# EAGLE schematic Stackduino-1.2 (EAGLE 7.3.0)
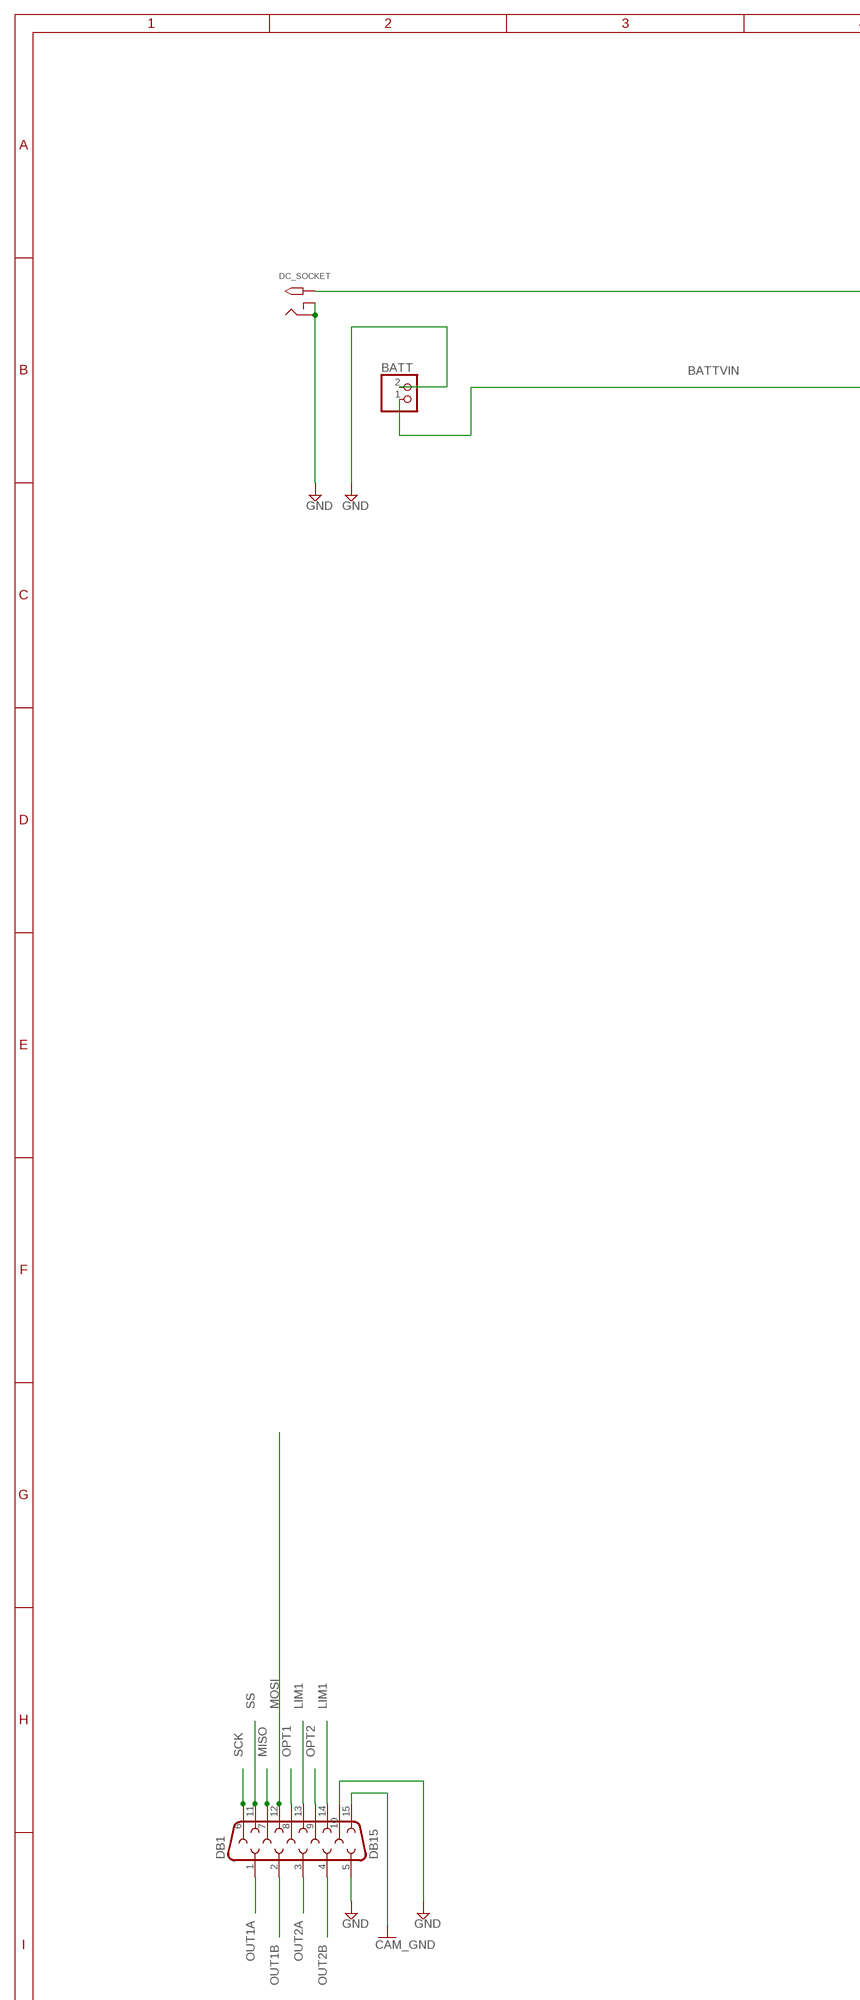
[diagram p0: schematic, sheet 1, part 1 of 2]
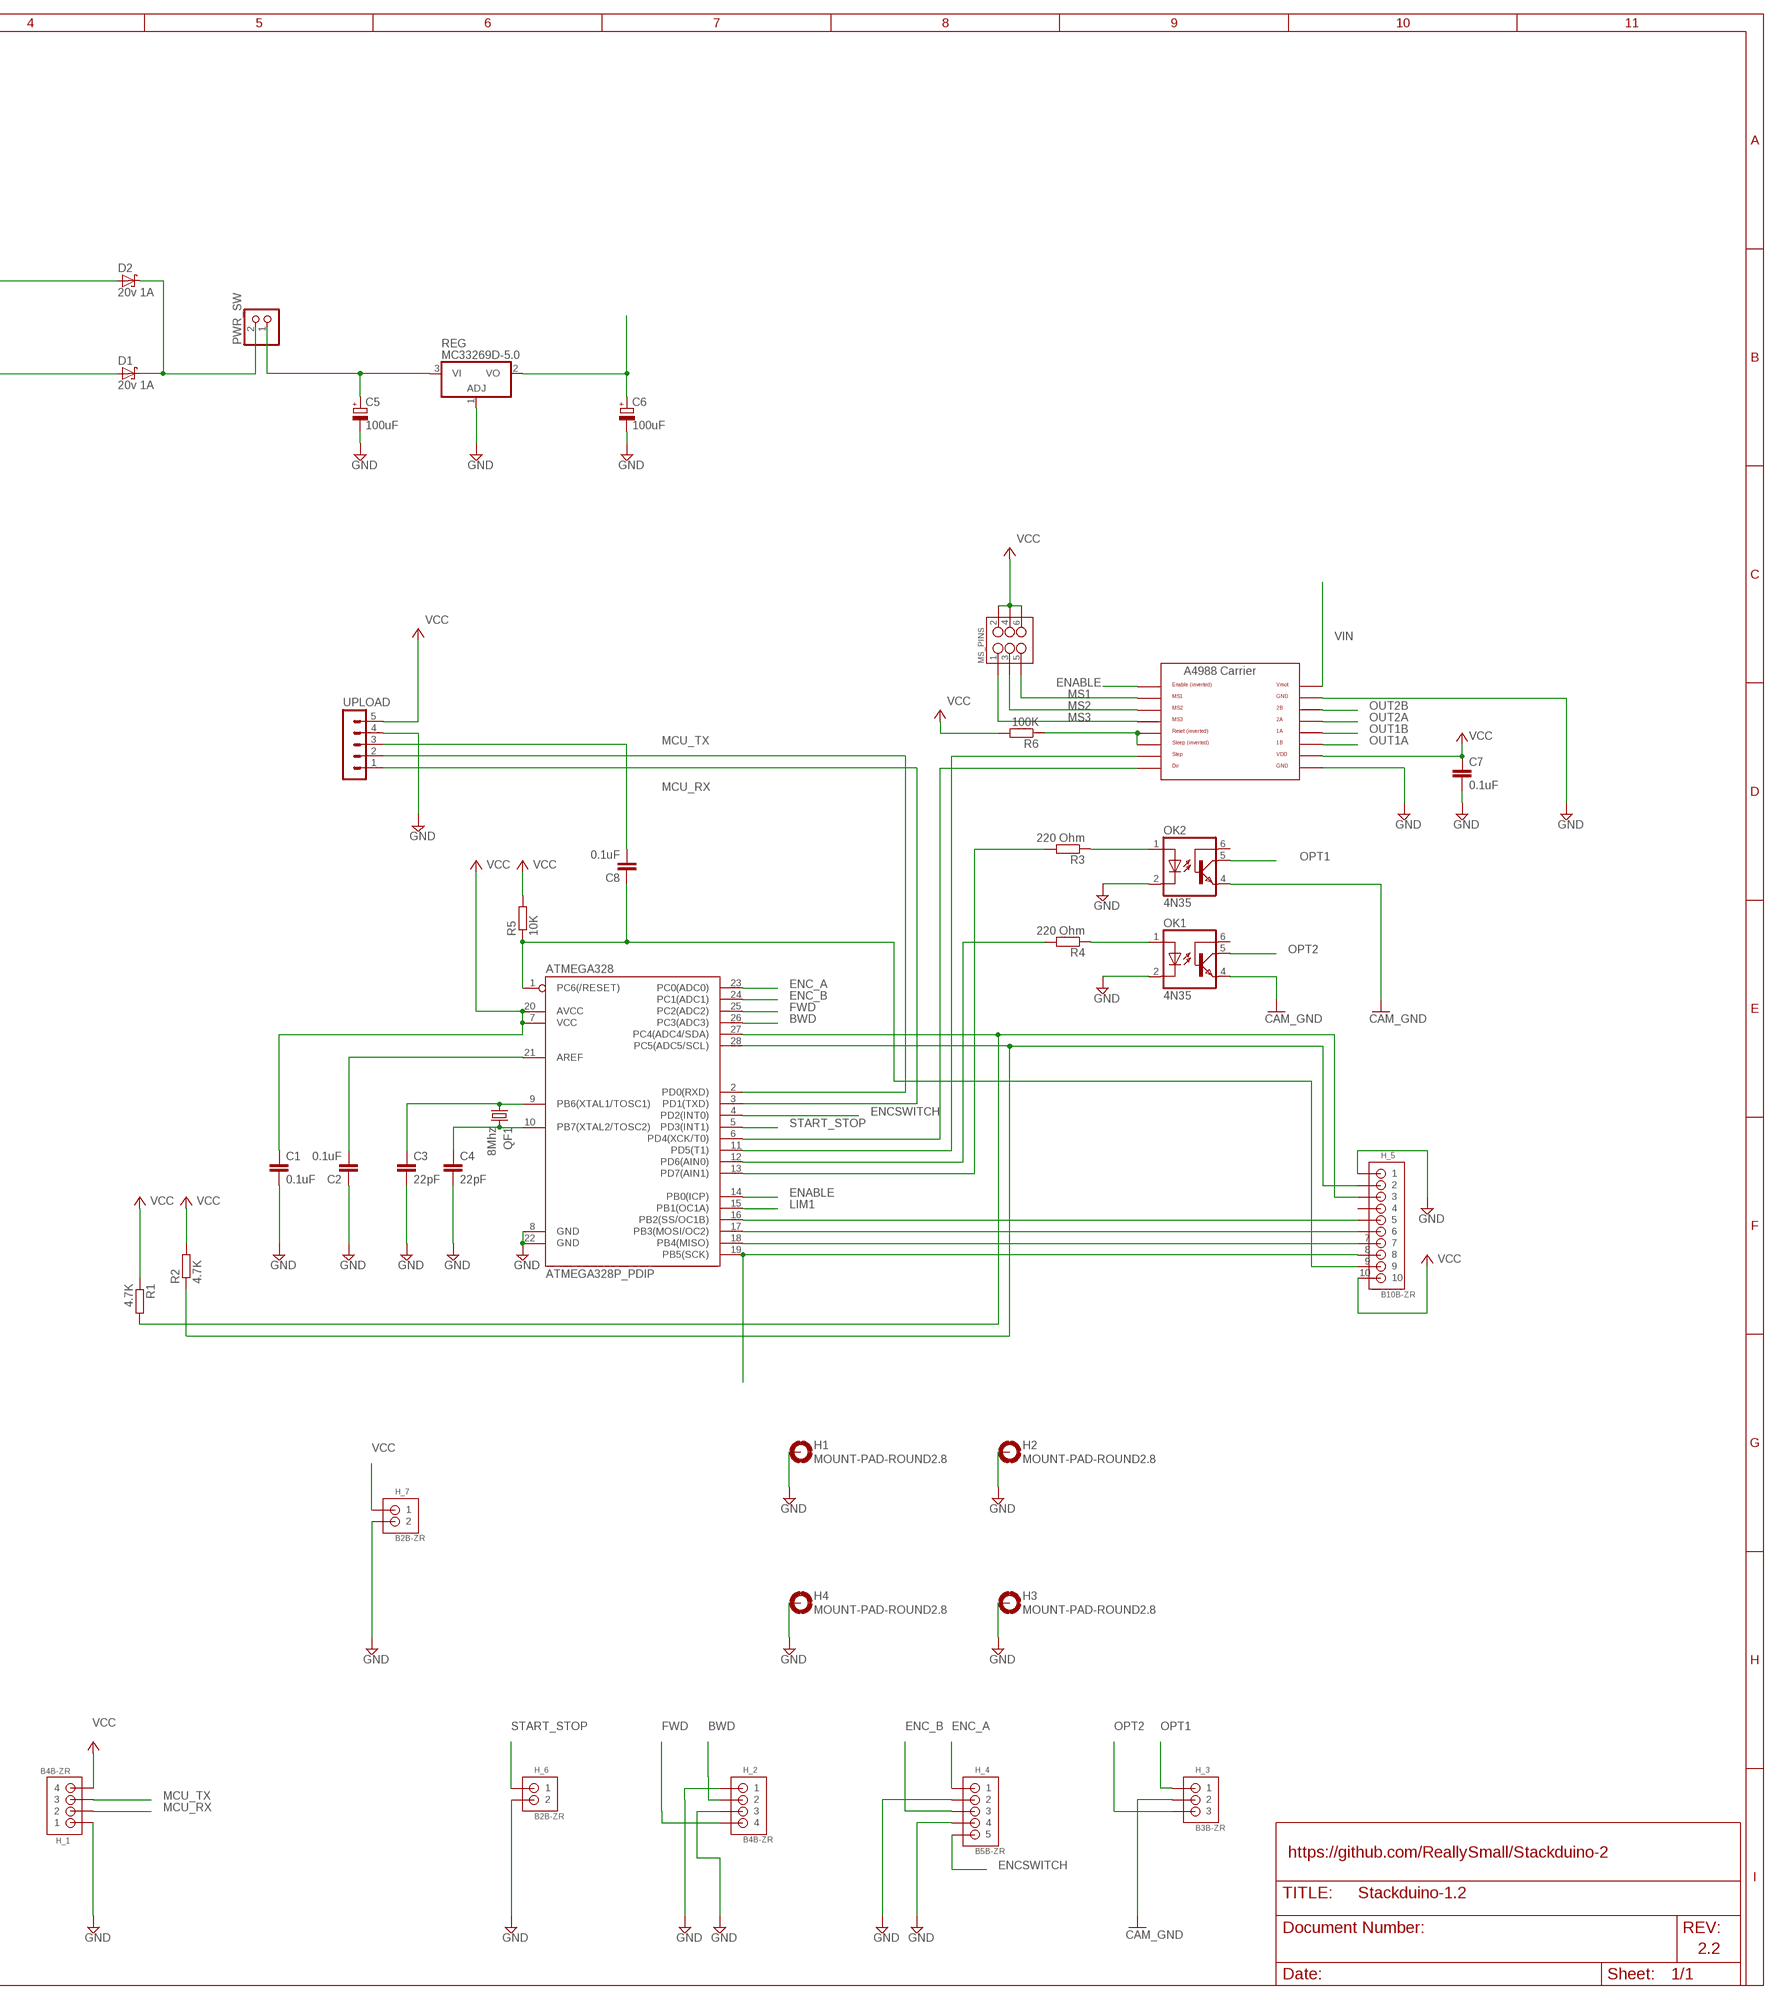
[diagram p1: schematic, sheet 1, part 2 of 2]

## Parts
A4988_CARRIER  A4988BREAKOUT  [A4988BREAKOUT]
ATMEGA328  ATMEGA328P_PDIP  [DIL28-3]
BATT  JST_2PIN-THM  [JST-PH-2-THM]
C1  0.1uF  C-EU025-030X050  [C025-030X050]
C2  0.1uF  C-EU025-030X050  [C025-030X050]
C3  22pF  C-EU025-030X050  [C025-030X050]
C4  22pF  C-EU025-030X050  [C025-030X050]
C5  100uF  CPOL-EUE2.5-7  [E2,5-7]
C6  100uF  CPOL-EUE2.5-7  [E2,5-7]
C7  0.1uF  C-EU025-030X050  [C025-030X050]
C8  0.1uF  C-EU025-030X050  [C025-030X050]
D1  20v 1A  SCHOTTKY-DIODEDO41  [DO41-10]
D2  20v 1A  SCHOTTKY-DIODEDO41  [DO41-10]
DB1  DB15  [DB15]
DC_SOCKET  2.1MMJACKTHM  [PJ-102A]
H1  MOUNT-PAD-ROUND2.8  [2,8-PAD]
H2  MOUNT-PAD-ROUND2.8  [2,8-PAD]
H3  MOUNT-PAD-ROUND2.8  [2,8-PAD]
H4  MOUNT-PAD-ROUND2.8  [2,8-PAD]
H_1  B4B-ZR  [B4B-ZR]
H_2  B4B-ZR  [B4B-ZR]
H_3  B3B-ZR  [B3B-ZR]
H_4  B5B-ZR  [B5B-ZR]
H_5  B10B-ZR  [B10B-ZR]
H_6  B2B-ZR  [B2B-ZR]
H_7  B2B-ZR  [B2B-ZR]
MS_PINS  M03X22X3_SILK_MALE_PTH  [2X3]
OK1  4N35  [DIL06]
OK2  4N35  [DIL06]
PWR_SW  JST_2PIN-THM  [JST-PH-2-THM]
QF1  8Mhz  CRYSTALHC49U-V  [HC49U-V]
R1  4.7K  R-EU_0207/7  [0207/7]
R2  4.7K  R-EU_0207/7  [0207/7]
R3  220 Ohm  R-EU_0207/7  [0207/7]
R4  220 Ohm  R-EU_0207/7  [0207/7]
R5  10K  R-EU_0207/7  [0207/7]
R6  100K  R-EU_0207/7  [0207/7]
REG  MC33269D-5.0  [DPACK]
UPLOAD  MA05-1  [MA05-1]

## Nets
A4988_RESET: A4988_CARRIER.RST A4988_CARRIER.SLP(SLEEP) R6.1
ACVIN: D2.A DC_SOCKET.TIP
BATTVIN: BATT.1 D1.A
BWD: ATMEGA328.26(PC3(ADC3)) H_2.2
CAM_GND: DB1.15 H_3.2 OK1.4(EMI) OK2.4(EMI)
DIR: A4988_CARRIER.DIR ATMEGA328.6(PD4(XCK/T0))
ENABLE: A4988_CARRIER.EN ATMEGA328.14(PB0(ICP))
ENC_A: ATMEGA328.23(PC0(ADC0)) H_4.1
ENC_B: ATMEGA328.24(PC1(ADC1)) H_4.3
ENCSWITCH: ATMEGA328.4(PD2(INT0)) H_4.5
FWD: ATMEGA328.25(PC2(ADC2)) H_2.4
GND: A4988_CARRIER.GND A4988_CARRIER.GND@0(GND) ATMEGA328.8(GND) ATMEGA328.22(GND) BATT.2 C1.2 C2.1 C3.2 C4.2 C5.- C6.- C7.2 DB1.5 DB1.10 DC_SOCKET.RING DC_SOCKET.RING_SW H1.B2,8(MOUNT) H2.B2,8(MOUNT) H3.B2,8(MOUNT) H4.B2,8(MOUNT) H_1.1 H_2.1 H_2.3 H_4.2 H_4.4 H_5.1 H_6.2 H_7.2 OK1.2(C) OK2.2(C) REG.1(ADJ) UPLOAD.4
I2C_SCL: ATMEGA328.28(PC5(ADC5/SCL)) H_5.2 R2.1
I2C_SDA: ATMEGA328.27(PC4(ADC4/SDA)) H_5.3 R1.2
LIM1: ATMEGA328.15(PB1(OC1A)) DB1.13 DB1.14
MCU_RX: ATMEGA328.2(PD0(RXD)) H_1.2 UPLOAD.2
MCU_TX: ATMEGA328.3(PD1(TXD)) H_1.3 UPLOAD.1
MISO: ATMEGA328.18(PB4(MISO)) DB1.7 H_5.7
MOSI: ATMEGA328.17(PB3(MOSI/OC2)) DB1.12 H_5.6
MS1: A4988_CARRIER.MS1 MS_PINS.5
MS2: A4988_CARRIER.MS2 MS_PINS.3
MS3: A4988_CARRIER.MS3 MS_PINS.1
N$2: D1.C D2.C PWR_SW.2
N$3: ATMEGA328.1(PC6(/RESET)) C8.1 H_5.9 R5.1
N$4: C8.2 UPLOAD.3
N$11: ATMEGA328.21(AREF) C2.2
OPT1: DB1.8 H_3.1 OK2.5(COL)
OPT1_IN: OK2.1(A) R3.1
OPT1_MCU: ATMEGA328.13(PD7(AIN1)) R3.2
OPT2: DB1.9 H_3.3 OK1.5(COL)
OPT2_IN: OK1.1(A) R4.1
OPT2_MCU: ATMEGA328.12(PD6(AIN0)) R4.2
OUT1A: A4988_CARRIER.1B DB1.1
OUT1B: A4988_CARRIER.1A DB1.2
OUT2A: A4988_CARRIER.2A DB1.3
OUT2B: A4988_CARRIER.2B DB1.4
SCK: ATMEGA328.19(PB5(SCK)) DB1.6 H_5.8
SS: ATMEGA328.16(PB2(SS/OC1B)) DB1.11 H_5.5
START_STOP: ATMEGA328.5(PD3(INT1)) H_6.1
STEP: A4988_CARRIER.STEP ATMEGA328.11(PD5(T1))
VCC: A4988_CARRIER.VDD ATMEGA328.7(VCC) ATMEGA328.20(AVCC) C1.1 C6.+ C7.1 H_1.4 H_5.10 H_7.1 MS_PINS.2 MS_PINS.4 MS_PINS.6 R1.1 R2.2 R5.2 R6.2 REG.2(VO) UPLOAD.5
VIN: A4988_CARRIER.VMOT C5.+ PWR_SW.1 REG.3(VI)
XTAL1: ATMEGA328.9(PB6(XTAL1/TOSC1)) C3.1 QF1.1
XTAL2: ATMEGA328.10(PB7(XTAL2/TOSC2)) C4.1 QF1.2
Unconnected: H_5.4 OK1.6(BAS) OK2.6(BAS)

## Notes on the sheet
- https://github.com/ReallySmall/Stackduino-2
- 2.2

## Library data of the parts
A4988_CARRIER = RepRapjr:A4988BREAKOUT
ATMEGA328 = SparkFun-DigitalIC:ATMEGA328P_PDIP: uC used in the Arduino 32kb flash, 1k EEPROM, 2k SRAM This is the through-hole version of this chip.
BATT PWR_SW = adafruit:JST_2PIN: JST 2-Pin Connectors of various flavors SMT-RA (S2B-PH-SM4) 4UConnector #17311 SMT (B2B-PH-SM4) THM-RA (S2B-PH) THM (B2B-PH)
C1-C4 C7 C8 = resistor:C-EU: CAPACITOR, European symbol
C5 C6 = rcl:CPOL-EU: POLARIZED CAPACITOR, European symbol
D1 D2 = adafruit:SCHOTTKY-DIODE: Schottky Diode
DB1 = SparkFun-Connectors:DB15: DB15 / VGA right angle through-hole female connector.
DC_SOCKET = adafruit:2.1MMJACK: 2.1mm x 5.5mm THM DC jack with internal switch. Digikey part #PJ-102A, 4UCON part #05537 2.1mm x 5.5mm SMT DC jack with internal switch. Digikey part #PJ-002A-SMT, 4UCON part #03267 By microbuilder.eu & adafruit.com
H1-H4 = holes:MOUNT-PAD-ROUND: MOUNTING PAD, round
H_1 H_2 = jst-connectors:B4B-ZR: JST-ZH Connector 4 pol, 1.5mm pitch Package: B4B-ZR Source: http://www.jst-mfg.com/product/pdf/eng/eZH.pdf
H_3 = jst-connectors:B3B-ZR: JST-ZH Connector 3 pol, 1.5mm pitch Package: B3B-ZR Source: http://www.jst-mfg.com/product/pdf/eng/eZH.pdf
H_4 = jst-connectors:B5B-ZR: JST-ZH Connector 5 pol, 1.5mm pitch Package: B5B-ZR Source: http://www.jst-mfg.com/product/pdf/eng/eZH.pdf
H_5 = jst-connectors:B10B-ZR: JST-ZH Connector 9 pol, 1.5mm pitch Package: B9B-ZR
H_6 H_7 = jst-connectors:B2B-ZR: JST-ZH Connector 2 pol, 1.5mm pitch Package: B2B-ZR
MS_PINS = SparkFun-Connectors:M03X2: 2x3 .1" header. Shrouded, with keying- CONN-10681 SMT- CONN-11415 Pogo pins- HW-11044; PROD_ID: CONN-09701
OK1 OK2 = optocoupler:4N35: MOTOROLA OPTO COUPLER; MF: FAIRCHILD SEMICONDUCTOR; MPN: 4N35; OC_FARNELL: 1328375; OC_NEWARK: 72K9946
QF1 = crystal:CRYSTAL: CRYSTAL; OC_FARNELL: 1666969; OC_NEWARK: unknown
R1-R6 = resistor:R-EU_: RESISTOR, European symbol
REG = linear:MC33269?*: Adjustable Output Low Dropout Voltage Regulator 800 mA Source: http://www.onsemi.com/pub/Collateral/MC33269-D.PDF
UPLOAD = con-lstb:MA05-1: PIN HEADER; OC_FARNELL: unknown; OC_NEWARK: unknown